# Altium schematic sheet QUTMS_chargeCtrl_v1.SchDoc
size B
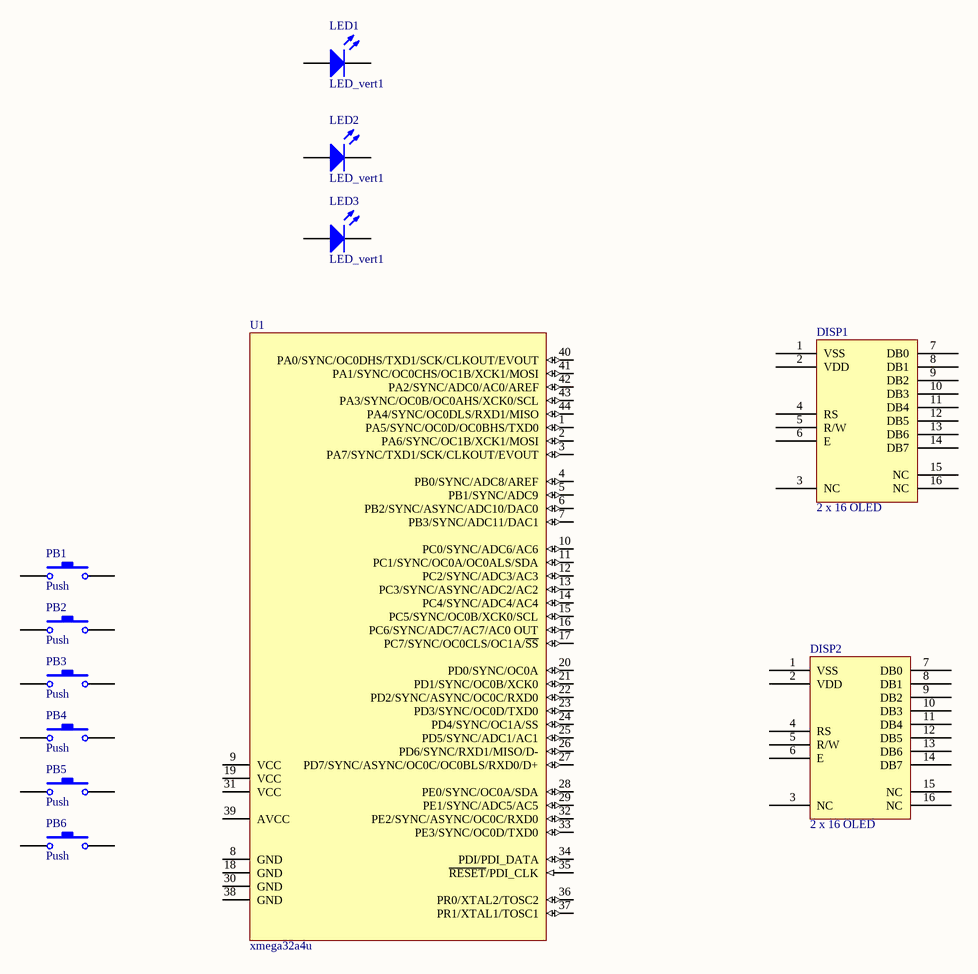
[diagram p0: QUTMS_chargeCtrl_v1.SchDoc]

## Parts
DISP1  2 x 16 OLED  [16_2_OLED]
DISP2  2 x 16 OLED  [16_2_OLED]
LED1  LED_vert1  [LEDvert1 - HIGH]
LED2  LED_vert1  [LEDvert1 - HIGH]
LED3  LED_vert1  [LEDvert1 - HIGH]
PB1  Push  [Pushbutton_Jaycar1]
PB2  Push  [Pushbutton_Jaycar1]
PB3  Push  [Pushbutton_Jaycar1]
PB4  Push  [Pushbutton_Jaycar1]
PB5  Push  [Pushbutton_Jaycar1]
PB6  Push  [Pushbutton_Jaycar1]
U1  xmega32a4u  [44A_L]

## Nets

Not connected (* = marked no-connect by the designer): DISP1 1(VSS) 2(VDD) 3(NC) 4(RS) 5(R/W) 6(E) 7(DB0) 8(DB1) 9(DB2) 10(DB3) 11(DB4) 12(DB5) 13(DB6) 14(DB7) 15(NC) 16(NC); DISP2 1(VSS) 2(VDD) 3(NC) 4(RS) 5(R/W) 6(E) 7(DB0) 8(DB1) 9(DB2) 10(DB3) 11(DB4) 12(DB5) 13(DB6) 14(DB7) 15(NC) 16(NC); LED1 1(A) 2(K); LED2 1(A) 2(K); LED3 1(A) 2(K); PB1 1 2; PB2 1 2; PB3 1 2; PB4 1 2; PB5 1 2; PB6 1 2; U1 1(PA5/SYNC/OC0D/OC0BHS/TXD0) 2(PA6/SYNC/OC1B/XCK1/MOSI) 3(PA7/SYNC/TXD1/SCK/CLKOUT/EVOUT) 4(PB0/SYNC/ADC8/AREF) 5(PB1/SYNC/ADC9) 6(PB2/SYNC/ASYNC/ADC10/DAC0) 7(PB3/SYNC/ADC11/DAC1) 8(GND) 9(VCC) 10(PC0/SYNC/ADC6/AC6) 11(PC1/SYNC/OC0A/OC0ALS/SDA) 12(PC2/SYNC/ADC3/AC3) 13(PC3/SYNC/ASYNC/ADC2/AC2) 14(PC4/SYNC/ADC4/AC4) 15(PC5/SYNC/OC0B/XCK0/SCL) 16(PC6/SYNC/ADC7/AC7/AC0_OUT) 17(PC7/SYNC/OC0CLS/OC1A/~{SS}) 18(GND) 19(VCC) 20(PD0/SYNC/OC0A) 21(PD1/SYNC/OC0B/XCK0) 22(PD2/SYNC/ASYNC/OC0C/RXD0) 23(PD3/SYNC/OC0D/TXD0) 24(PD4/SYNC/OC1A/SS) 25(PD5/SYNC/ADC1/AC1) 26(PD6/SYNC/RXD1/MISO/D-) 27(PD7/SYNC/ASYNC/OC0C/OC0BLS/RXD0/D+) 28(PE0/SYNC/OC0A/SDA) 29(PE1/SYNC/ADC5/AC5) 30(GND) 31(VCC) 32(PE2/SYNC/ASYNC/OC0C/RXD0) 33(PE3/SYNC/OC0D/TXD0) 34(PDI/PDI_DATA) 35(~{RESET}/PDI_CLK) 36(PR0/XTAL2/TOSC2) 37(PR1/XTAL1/TOSC1) 38(GND) 39(AVCC) 40(PA0/SYNC/OC0DHS/TXD1/SCK/CLKOUT/EVOUT) 41(PA1/SYNC/OC0CHS/OC1B/XCK1/MOSI) 42(PA2/SYNC/ADC0/AC0/AREF) 43(PA3/SYNC/OC0B/OC0AHS/XCK0/SCL) 44(PA4/SYNC/OC0DLS/RXD1/MISO)

## Library data of the parts
DISP1 DISP2 = OLED_2_16_AA
PB1-PB6 = PushButton_Jaycar_PCB
U1 = ATxmega32A4U-AU: 8/16-bit AVR XMEGA A4 Microcontroller, 1.6-3.6V, 32KB + 4KB Flash, 1KB EEPROM, 4KB SRAM, 44-pin TQFP, Industrial Grade (-40°C to 85°C), Pb-Free; Published: 1-Apr-2010; DatasheetVersion: revN, Feb-2010; PackageVersion: rev.B, Oct-2001; PackageReference: 44A; Publisher: Altium Limited; PackageDescription: 44-Pin Plastic Thin Profile Quad Flat Pack, 10 x 10 x 1.0 mm Body, 0.8 mm Pitch (TQFP); Supplier 1: Digi-Key; Supplier Part Number 1: ATXMEGA32A4-AU-ND; Supplier 2: Farnell; Supplier Part Number 2: 1748557; Supplier 3: Mouser; Supplier Part Number 3: 556-ATXMEGA32A4-AU; ComponentLink1Description: Manufacturer Link; ComponentLink1URL: http://www.atmel.com/products/avr/default.asp?; ComponentLink2Description: ATxmega16A4/32A4/64A4/128A4 Datasheet; ComponentLink2URL: http://www.atmel.com/dyn/resources/prod_documents/doc8069.pdf; ComponentLink3Description: Atmel.com Home; ComponentLink3URL: http://www.atmel.com